# Altium schematic sheet HA_HiPower.SchDoc: transc
size A4; Date: 11/21/2016 9:12:53 PM; SheetNumber: 3; PageSetup: Record=PageOptions|CenterHorizontal=True|CenterVertical=True|PrintScale=1.02|XCorrection=1.00|YCorrection=1.00|PrintKind=0|BorderSize=5000000|LeftOffset=0|BottomOffset=0|Orientation=2|PaperLength=1000|PaperWidth=1000|Scale=100|PaperSource=7|PrintQuality=-3|MediaType=1|DitherType=10|PrintScaleMode=1|PaperKind=A4 (Borderless)|PaperIndex=274
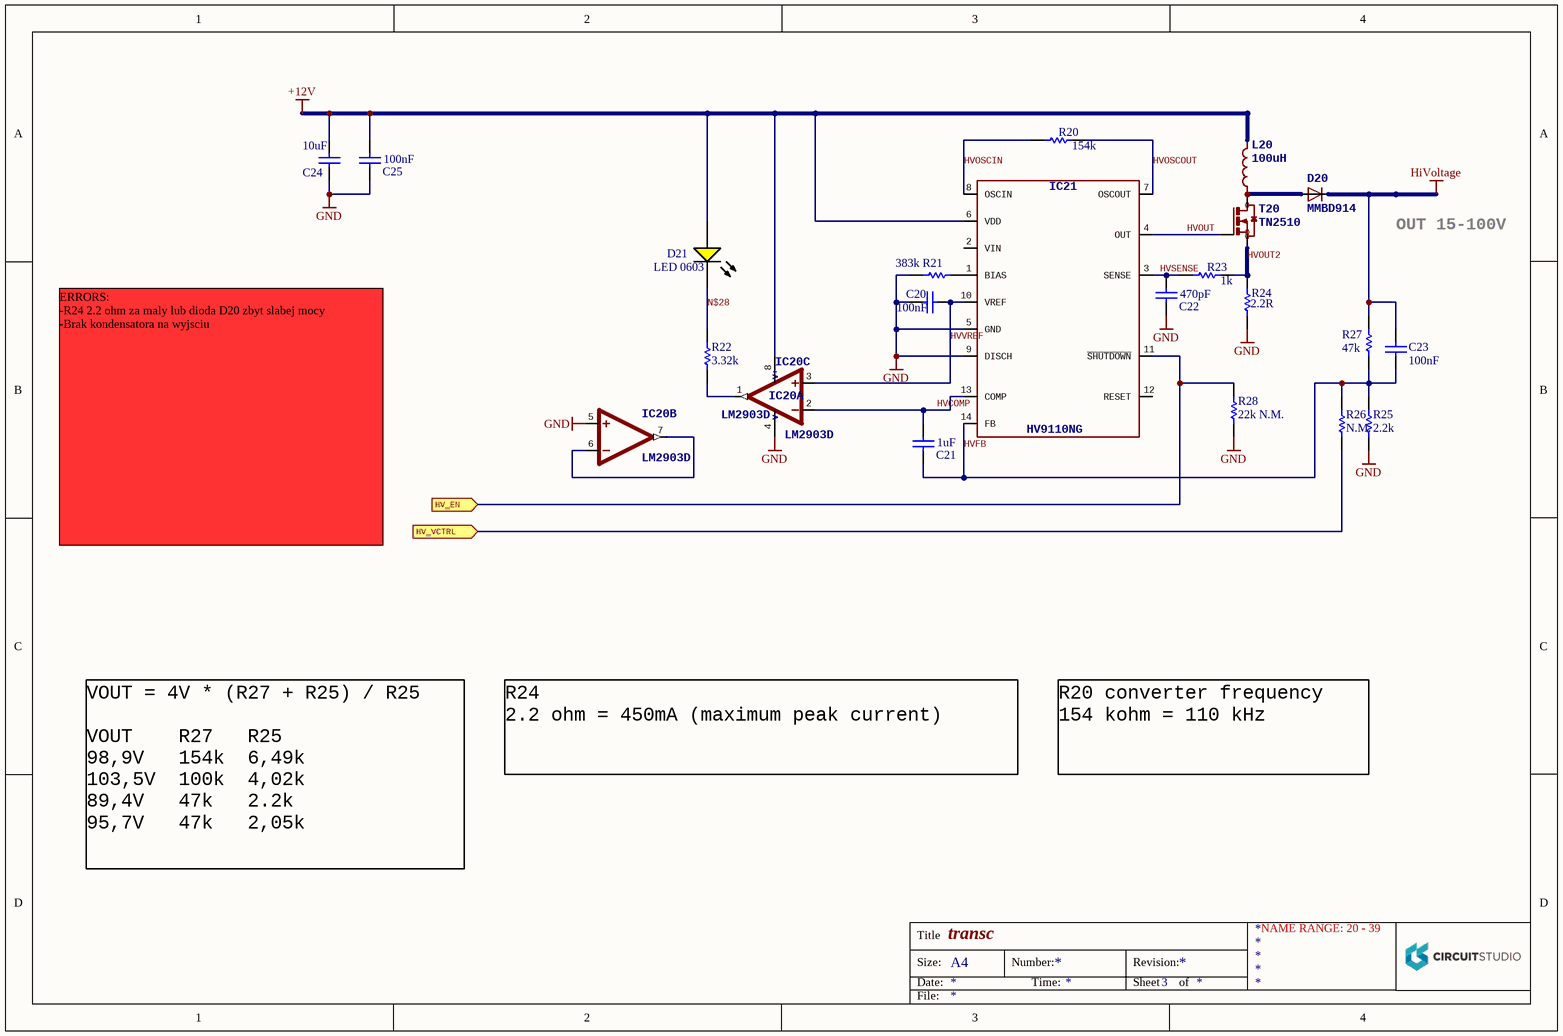
[diagram p0: HA_HiPower.SchDoc]

## Parts
C20  value 100nF  [CAPC0805(2012)145_L]  (hidden comment: 100nF 100V)
C21  value 1uF  [CAPC0805(2012)145_L]  (hidden comment: 1uF 100V)
C22  value 470pF  [CAPC0805(2012)145_L]  (hidden comment: 470pF 100V)
C23  value 100nF  [CAPC0805(2012)145_L]  (hidden comment: 100nF 100V)
C24  value 10uF  [CAPC1206(3216)190_N]  (hidden comment: 10uF 35V)
C25  value 100nF  [CAPC0805(2012)145_L]  (hidden comment: 100nF 100V)
D20  MMBD914  [SOT23]
D21  LED 0603  [LTST-C190KSKT_V]
IC20  LM2903D  [SO08]  (parts A,B,C of 3)
IC21  HV9110NG  [SOIC14]
L20  100uH  [LPS8045B]
R20  154k  [RESC0603(1608)_N]
R21  383k  [RESC0603(1608)_N]
R22  3.32k  [RESC0603(1608)_N]
R23  1k  [RESC0603(1608)_N]
R24  value 2.2R  [RESC2512(6432)_M]  (hidden comment: 2.2R 5%)
R25  2.2k  [RESC0603(1608)_N]
R26  N.M.  [RESC0603(1608)_N]
R27  47k  [RESC0603(1608)_N]
R28  22k N.M.  [RESC0603(1608)_N]
T20  TN2510  [SOT89]

## Ports
HV_EN (in), HV_VCTRL (in)

## Nets
+12V: C24.2 C25.2 D21.1(A) IC20.8(V+) IC21.6(VDD) L20.2
GND: C20.2 C22.1 C24.1 C25.1 IC20.4(V-) IC20.5(+IN) IC21.5(GND) IC21.9(DISCH) R21.1 R24.1 R25.1 R28.1
HiVoltage: C23.1 D20.C R27.2
HV_EN: IC21.11(~{SHUTDOWN}) R28.2 ; port HV_EN
HV_VCTRL: R26.1 ; port HV_VCTRL
HVCOMP: C21.2 IC20.2(-IN) IC21.13(COMP)
HVFB: C21.1 C23.2 IC21.14(FB) R25.2 R26.2 R27.1
HVOSCIN: IC21.8(OSCIN) R20.1
HVOSCOUT: IC21.7(OSCOUT) R20.2
HVOUT: IC21.4(OUT) T20.1(G)
HVOUT2: R23.2 R24.2 T20.3(S)
HVSENSE: C22.2 IC21.3(SENSE) R23.1
HVVREF: C20.1 IC20.3(+IN) IC21.10(VREF)
N$28: D21.2(K) R22.1
NetD20_B: D20.B(A) L20.1 T20.2(D)
NetIC20_1: IC20.1(OUT) R22.2
NetIC20_6: IC20.6(-IN) IC20.7(OUT)
NetIC21_1: IC21.1(BIAS) R21.2

Not connected (* = marked no-connect by the designer): IC21 2(VIN) 12(RESET)

## Notes on the sheet
- OUT 15-100V
- ERRORS:
  -R24 2.2 ohm za maly lub dioda D20 zbyt slabej mocy
  -Brak kondensatora na wyjsciu
- R24
  2.2 ohm = 450mA (maximum peak current)
- R20 converter frequency
  154 kohm = 110 kHz
- VOUT = 4V * (R27 + R25) / R25
  VOUT    R27   R25
  98,9V   154k  6,49k
  103,5V  100k  4,02k
  89,4V   47k   2.2k
  95,7V   47k   2,05k
- NAME RANGE: 20 - 39
- Title
- Size:
- Date:
- A4
- Number:
- Time:
- Revision:
- Sheet
- of
- File:

## Library data of the parts
C20-C23 C25 = CMP-1036-04431-1: Case-Metric: 2012; Tolerance: Â±20%; Case-EIA: 0805; Technology: SMT; Rated Voltage: 100 V; Max Thickness: 1.45 mm
C24 = CMP-1037-04990-1: CAP 1206 (3216 Metric) Thickness 1.9mm SMD; Rated Voltage: 10 V; Tolerance: Â±20%; Case-EIA: 1206; Case-Metric: 3216; Max Thickness: 1.9 mm; Technology: SMT
D20 = DIODE-SOT23
D21 = CMP-1674-00009-1: Voltage Rating: 50 V; Case\Package: 0603; Power Rating: 100 mW; Tolerance: 1%; Resistance: 12 kohm; Packaging: Tape and Reel; RoHSCompliant: true; Height: 0.45 mm; Max Operating Temperature: 155 degC; Mount: Surface Mount; DatasheetVersion: Rev. I, 10/2012; Min Operating Temperature: -55 degC; PackageReference: C190KSKT; ComponentLink1Description: Manufacturer URL; Length: 1.6 mm; REACH SVHC: No SVHC; Case Code (Imperial): 0603; Voltage Rating (DC): 50 V; PackageDescription: 2-Pin Surface Mount Device, Body 1.6 x 0.8 mm; Case Code (Metric): 1608; Package Quantity: 5000; ComponentLink2Description: Datasheet; Width: 0.8 mm; Pins: 2; ComponentLink2URL: http://optoelectronics.liteon.com/upload/download/DS-22-99-0189/S_110_LTST-C190KSKT.pdf; ComponentLink1URL: http://www.us.liteon.com/
IC20 = LM2903D: COMPARATOR
L20 = LDE1205: MPN: LPS8045B-104; Inductance: 100uH
R20 R27 R28 = CMP-1012-00122-1: 1% 0603 SMD; Value: 154k Ohm; Tolerance: 1 %
R21 = CMP-1012-00122-1: 1% 0603 SMD; Value: 383k Ohm; Tolerance: 1 %
R22 = CMP-1012-00122-1: 1% 0603 SMD; Value: 3.32k Ohm; Tolerance: 1 %
R23 = CMP-1012-00122-1: 1% 0603 SMD; Value: 1k Ohm; Tolerance: 1 %
R24 = CMP-1018-00050-1: 2.2R 1W 5% 2512 SMD; Case-EIA: 2512; Case-Metric: 6432; Tolerance: 5 %; Power: 1 W; Technology: SMT
R25 = CMP-1012-00122-1: 1% 0603 SMD; Value: 6.49k Ohm; Tolerance: 1 %
R26 = CMP-1012-00122-1: 1% 0603 SMD; Value: k Ohm; Tolerance: 1 %
T20 = MOSFET_NSOT89